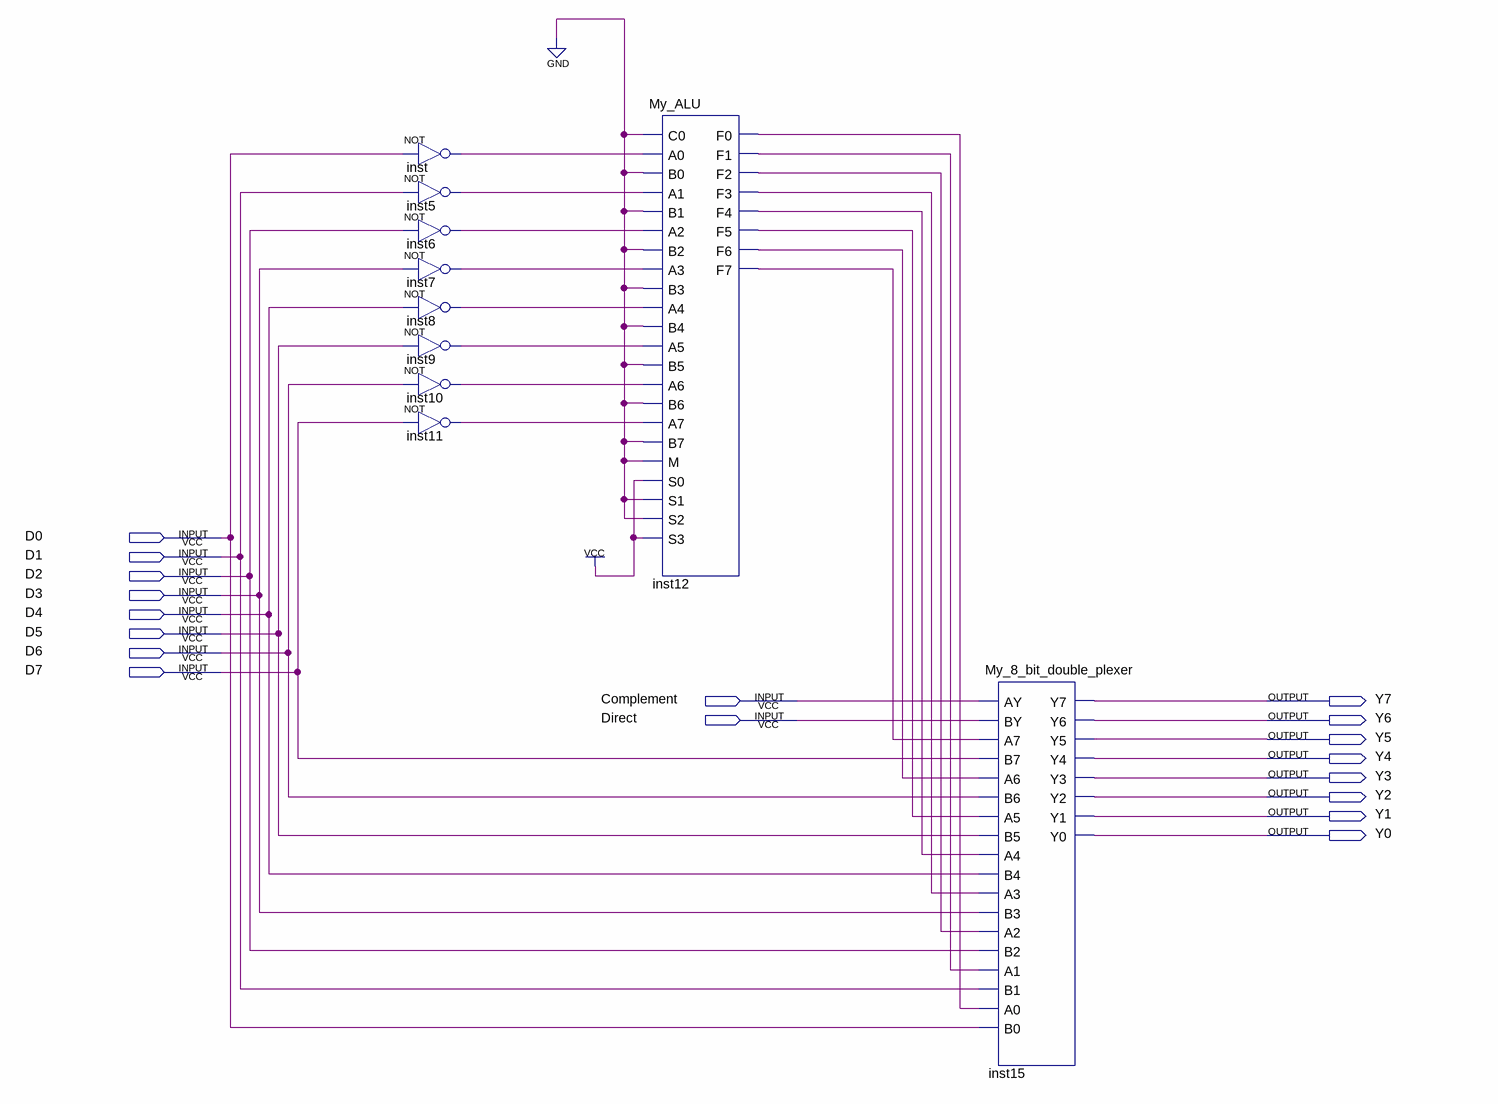
[diagram p0: schematic sheet]
// Quartus schematic My_Complementer.bdf as structural Verilog: 10 symbols, 18 pins
module My_Complementer (
  input  D0,
  input  D1,
  input  D2,
  input  D3,
  input  D4,
  input  D5,
  input  D6,
  input  D7,
  input  Complement,
  input  Direct,
  output Y7,
  output Y6,
  output Y5,
  output Y4,
  output Y3,
  output Y2,
  output Y1,
  output Y0
);

  wire inst5_out, inst6_out, inst7_out, inst8_out, inst9_out, inst10_out, inst11_out, inst12_f0, inst12_f1,
       inst12_f2, inst12_f3, inst12_f4, inst12_f5, inst12_f6, inst12_f7, inst_out;

  not inst (inst_out, D0);
  not inst5 (inst5_out, D1);
  not inst6 (inst6_out, D2);
  not inst7 (inst7_out, D3);
  not inst8 (inst8_out, D4);
  not inst9 (inst9_out, D5);
  not inst10 (inst10_out, D6);
  not inst11 (inst11_out, D7);
  My_ALU inst12 (
    .C0(1'b0), .A0(inst_out), .B0(1'b0), .A1(inst5_out), .B1(1'b0), .A2(inst6_out), .B2(1'b0),
    .A3(inst7_out), .B3(1'b0), .A4(inst8_out), .B4(1'b0), .A5(inst9_out), .B5(1'b0), .A6(inst10_out),
    .B6(1'b0), .A7(inst11_out), .B7(1'b0), .M(1'b0), .S0(1'b1), .S1(1'b0), .S2(1'b0), .S3(1'b1),
    .F0(inst12_f0), .F1(inst12_f1), .F2(inst12_f2), .F3(inst12_f3), .F4(inst12_f4), .F5(inst12_f5),
    .F6(inst12_f6), .F7(inst12_f7));
  My_8_bit_double_plexer inst15 (
    .AY(Complement), .BY(Direct), .A7(inst12_f7), .B7(D7), .A6(inst12_f6), .B6(D6), .A5(inst12_f5), .B5(D5),
    .A4(inst12_f4), .B4(D4), .A3(inst12_f3), .B3(D3), .A2(inst12_f2), .B2(D2), .A1(inst12_f1), .B1(D1),
    .A0(inst12_f0), .B0(D0), .Y7(Y7), .Y6(Y6), .Y5(Y5), .Y4(Y4), .Y3(Y3), .Y2(Y2), .Y1(Y1), .Y0(Y0));
endmodule
